# Altium schematic sheet key.SchDoc
size A
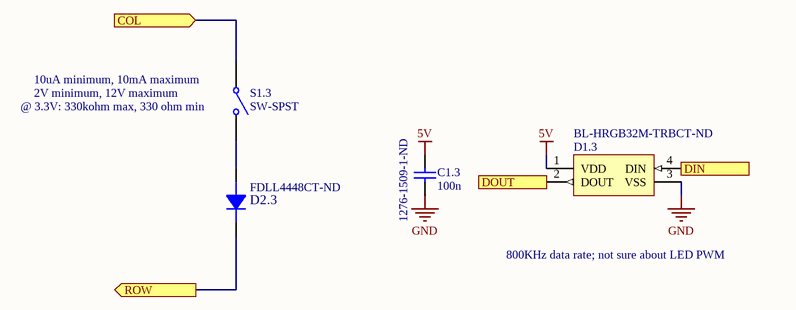
[diagram p0: key.SchDoc]

## Parts
C1.3  Supplier Part Number 1: 1276-1509-1-ND  [0402]  (hidden comment: 100n)
D1.3  Supplier Part Number 1: BL-HRGB32M-TRBCT-ND  [BL-HRGB32M-TRB]  (hidden comment: Addressable RGB LED)
D2.3  Supplier Part Number 1: FDLL4448CT-ND  [SOD-80]
S1.3  SW-SPST  [PG1350]

## Ports
COL (in), DIN (in), DOUT (out), ROW (out)

## Nets
5V: C1.3.1 D1.3.1(VDD)
GND: C1.3.2 D1.3.3(VSS)
COL: S1.3.1(COMMON) ; port COL
DIN: D1.3.4(DIN) ; port DIN
DOUT: D1.3.2(DOUT) ; port DOUT
ROW: D2.3.K ; port ROW
NetD2.3_A: D2.3.A S1.3.2(NO)

## Notes on the sheet
- (near S1.3) @ 3.3V: 330kohm max, 330 ohm min
- (near S1.3) 10uA minimum, 10mA maximum
- 2V minimum, 12V maximum
- 800KHz data rate; not sure about LED PWM

## Library data of the parts
C1.3 = CAPACITOR NON_POL: Value: 100n; Supplier 1: Digi-Key
D1.3 = BL-HRGB32M-TRB: Supplier 1: Digi-Key
D2.3 = DIODE: Supplier 1: Digi-Key
S1.3 = SW-SPST: Single-Pole, Single-Throw Switch; Manufacturer: Kailh; Manufacturer Part Number: PG1350; Supplier: NovelKeys